# EAGLE schematic main (EAGLE 7.2.0)
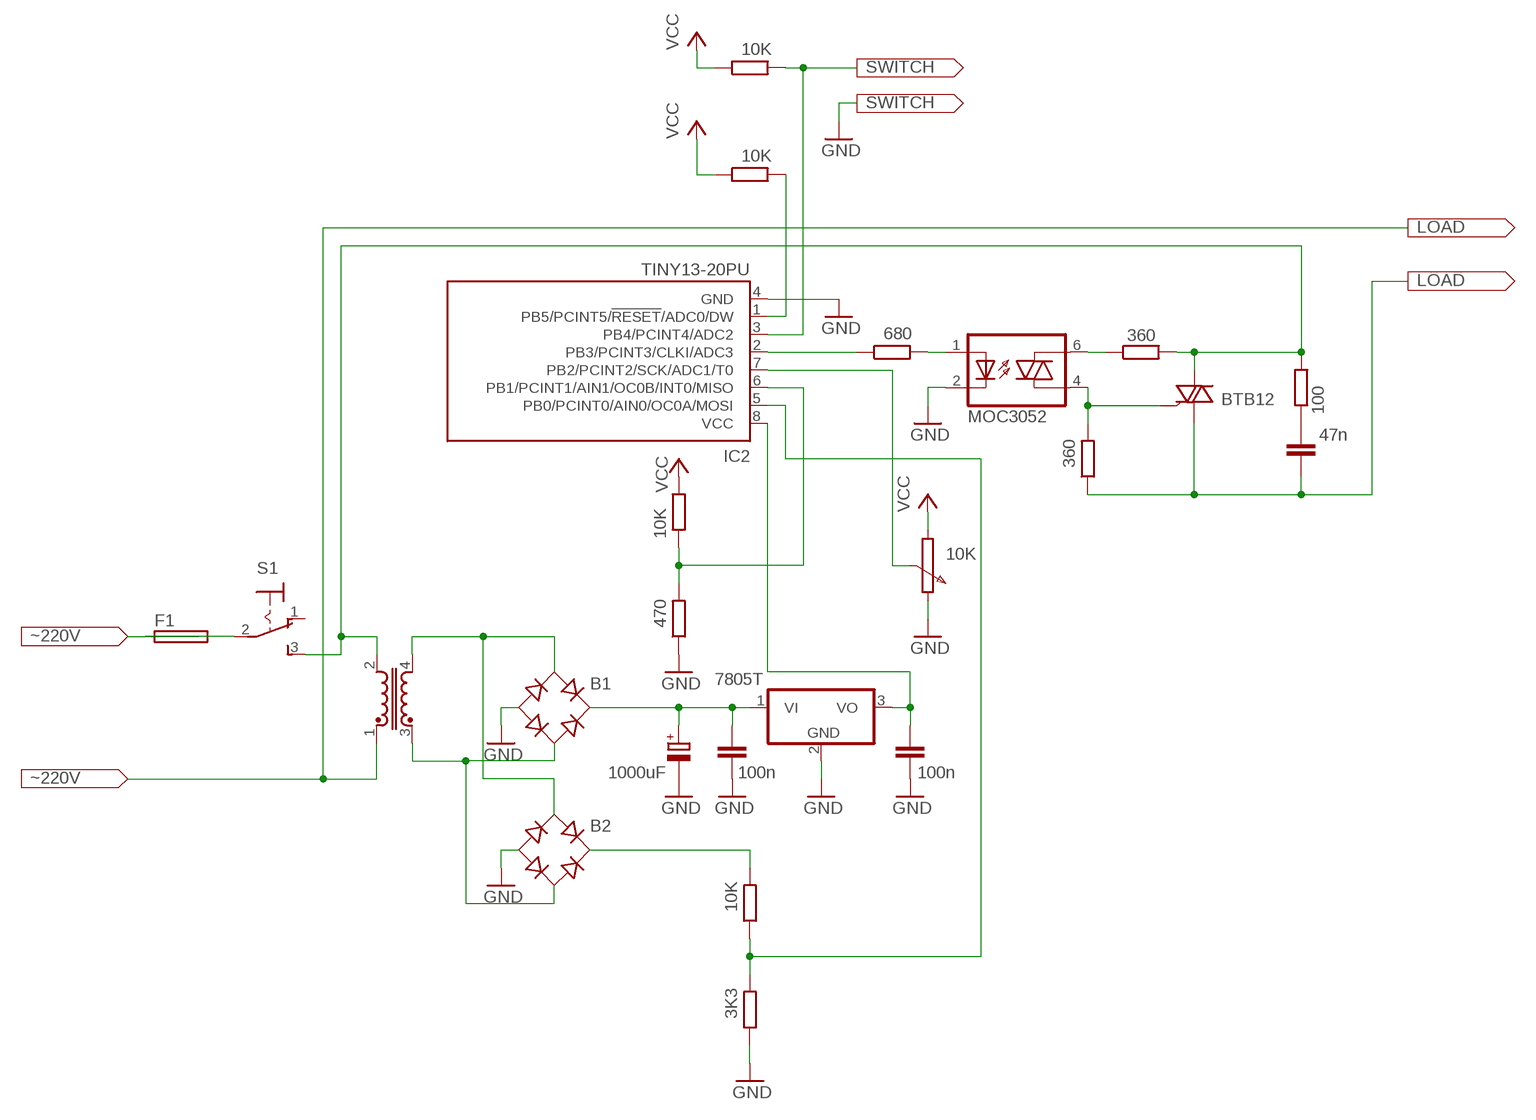
[diagram p0: schematic, sheet 1]
C1 (ELKO): VAL: 1000uF
C2 (C): 100N: 100n
C3 (C): 100N: 100n
C4 (C): VAL: 47n
P1 (POT): VAL: 10K

## Parts
B1  MB6S  [SOIC-4]
B2  MB6S  [SOIC-4]
F1  FUSEGSH15  [GSH15]
IC1  7805T  [TO220H]
IC2  TINY13-20PU  [DIL08]
OK1  MOC3052  MOC3022M  [DIL06]
R1  680  R-EU_0204/7  [0204/7]
R2  360  R-EU_0204/7  [0204/7]
R3  360  R-EU_0204/7  [0204/7]
R4  100  R-EU_0204/7  [0204/7]
R5  10K  R-EU_0204/7  [0204/7]
R6  10K  R-EU_0204/7  [0204/7]
R7  10K  R-EU_0204/7  [0204/7]
R8  3K3  R-EU_0204/7  [0204/7]
R9  10K  R-EU_0204/7  [0204/7]
R10  470  R-EU_0204/7  [0204/7]
S1  320-916  [320-916]
T2  BTB12  TIC206D  [TO220BV]
TR3  U15-TRANSFORMER  [U15]

## Nets
GND: B1.- B2.- IC1.2(GND) IC2.4(GND) OK1.2(C) R8.1 R10.1
N$1: IC2.2(PB3/PCINT3/CLKI/ADC3) R1.1
N$2: OK1.1(A) R1.2
N$3: IC2.7(PB2/PCINT2/SCK/ADC1/T0)
N$4: IC2.6(PB1/PCINT1/AIN1/OC0B/INT0/MISO) R9.1 R10.2
N$5: B1.~1(AC1) B2.~1(AC1) TR3.4
N$6: B1.~2(AC2) B2.~2(AC2) TR3.3
N$7: B1.+ IC1.1(VI)
N$8: IC1.3(VO) IC2.8(VCC)
N$9: B2.+ R7.2
N$11: F1.1 S1.2(P)
N$12: R2.2 R4.2 S1.3(S) T2.T2(A2) TR3.2
N$13: IC2.3(PB4/PCINT4/ADC2) R5.2
N$14: TR3.1
N$15: OK1.6(A2) R2.1
N$16: OK1.4(A1) R3.2 T2.G
N$17: R3.1 T2.T1(A1)
N$18: IC2.5(PB0/PCINT0/AIN0/OC0A/MOSI) R7.1 R8.2
N$20: IC2.1(PB5/PCINT5/!RESET!/ADC0/DW) R6.2
VCC: R5.1 R6.1 R9.2
Unconnected: F1.2 R4.1 S1.1(O)

## Library data of the parts
B1 B2 = rectifier:MB*S: Bridge Rectifier Source: http://www.fairchildsemi.com/ds/MB/MB6S.pdf
F1 = fuse:FUSE: Fuse; OC_FARNELL: unknown; OC_NEWARK: unknown
IC1 = linear:78*: Positive VOLTAGE REGULATOR Source: http://cache.national.com/ds/LM/LM78L05.pdf http://www.fairchildsemi.com/ds/LM/LM7805.pdf
IC2 = atmel:TINY13: 8-bit AVR Microcontroller with 1K Bytes In-System Programmable Flash Source: http://www.atmel.com/dyn/resources/prod_documents/2535S.pdf; MPN: ATTINY13-20PU; OC_FARNELL: 9171550; OC_NEWARK: 96K6521
OK1 = optocoupler-2:MOC30*M: RANDOM-PHASE OPTOISOLATORS TRIAC DRIVER OUTPUT Source: http://www.fairchildsemi.com MOC3020-M.pdf
R1-R10 = resistor:R-EU_: RESISTOR, European symbol
S1 = switch:320-916: TOGGLE SWITCH distributor RS Components
T2 = triac:TIC206: TRIAC Source: http://www.bourns.com/pdfs/tic206.pdf
TR3 = inductor-neosid:U15: TRANSFORMER U15; OC_FARNELL: unknown; OC_NEWARK: unknown